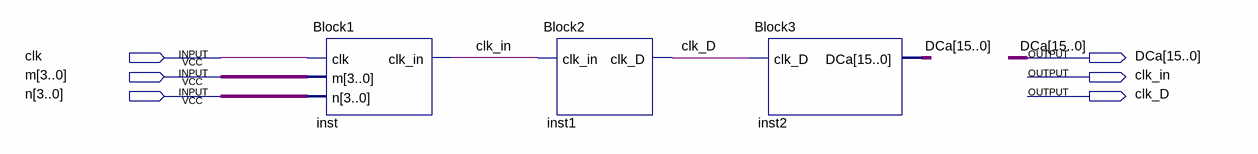
[diagram p0: schematic sheet]
// Quartus schematic Block_result.bdf as structural Verilog: 3 symbols, 6 pins
module Block_result (
  input  clk,
  input  [3:0] m,
  input  [3:0] n,
  output [15:0] DCa,
  output clk_in,
  output clk_D
);

  Block1 inst (.clk(clk), .m(m), .n(n), .clk_in(clk_in));
  Block2 inst1 (.clk_in(clk_in), .clk_D(clk_D));
  Block3 inst2 (.clk_D(clk_D), .DCa(DCa));
endmodule
